# EAGLE design RasPi_plate (EAGLE 7.4.0)
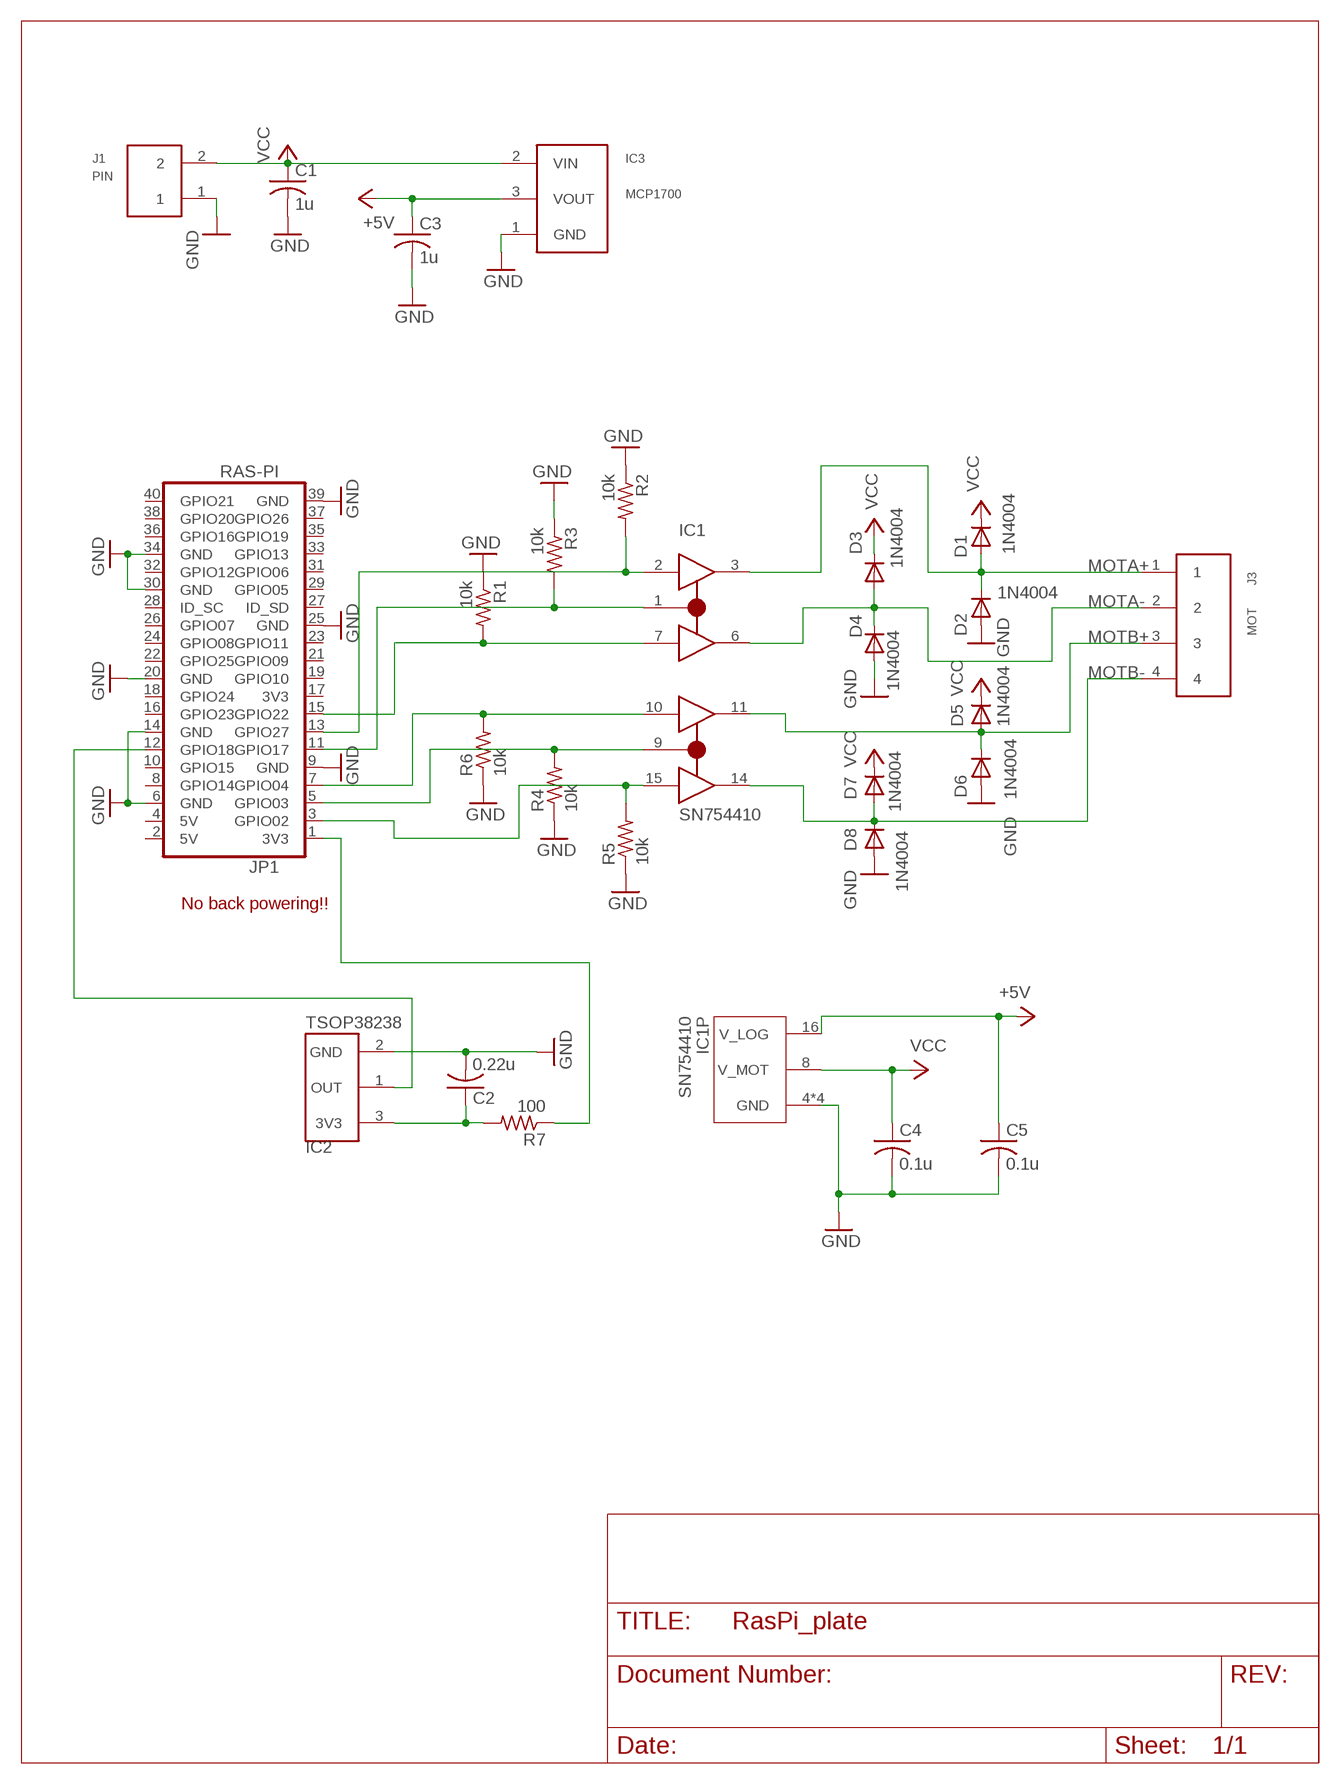
[diagram p0: schematic, sheet 1]

## Parts
C1  1u  C-USC0805  [C0805]
C2  0.22u  C-USC0805  [C0805]
C3  1u  C-USC0805  [C0805]
C4  0.1u  C-USC0805  [C0805]
C5  0.1u  C-USC0805  [C0805]
D1  1N4004  [DO41-10]
D2  1N4004  [DO41-10]
D3  1N4004  [DO41-10]
D4  1N4004  [DO41-10]
D5  1N4004  [DO41-10]
D6  1N4004  [DO41-10]
D7  1N4004  [DO41-10]
D8  1N4004  [DO41-10]
IC1  SN754410  [DIL16]
IC2  TSOP38238  [TSOP38238]
IC3  MCP1700  [TO92]
J1  PIN  2PINHEADER  [2PINHEAD]
J3  MOT  4PINHEADER  [4PINHEAD]
JP1  RAS-PI  40W_PI_HAT_TPH  [2X20]
R1  10k  R-US_R0805  [R0805]
R2  10k  R-US_R0805  [R0805]
R3  10k  R-US_R0805  [R0805]
R4  10k  R-US_R0805  [R0805]
R5  10k  R-US_R0805  [R0805]
R6  10k  R-US_R0805  [R0805]
R7  100  R-US_R0805  [R0805]

## Nets
1EN: IC1.1(1,2EN) JP1.11(GPIO17) R3.2
+3V3: C3.1 C5.1 IC1.16(V_LOG) IC3.3(VOUT) ; supply symbol labelled +5V
GND: C1.2 C2.2 C3.2 C4.2 C5.2 D2.A D4.A D6.A D8.A IC1.4(GND) IC1.5(GND) IC1.12(GND) IC1.13(GND) IC2.2(GND) IC3.1(GND) J1.1 JP1.6(GND) JP1.9(GND) JP1.14(GND) JP1.20(GND) JP1.25(GND) JP1.30(GND) JP1.34(GND) JP1.39(GND) R1.1 R2.1 R3.1 R4.1 R5.1 R6.1
MOTA+ [Power]: D1.A D2.C IC1.3(1Y) J3.1
MOTA- [Power]: D3.A D4.C IC1.6(2Y) J3.2
MOTB+ [Power]: D5.A D6.C IC1.11(3Y) J3.3
MOTB- [Power]: D7.A D8.C IC1.14(4Y) J3.4
N$2: IC1.7(2A) JP1.15(GPIO22) R1.2
N$4: IC1.10(3A) JP1.7(GPIO04) R6.2
N$5: IC1.9(3,4EN) JP1.5(GPIO03) R4.2
N$6: IC2.1(OUT) JP1.12(GPIO18)
N$7: C2.1 IC2.3(3V3) R7.2
N$8: JP1.1(3V3) R7.1
N$9: IC1.2(1A) JP1.13(GPIO27) R2.2
N$12: IC1.15(4A) JP1.3(GPIO02) R5.2
VCC [Power]: C1.1 C4.1 D1.C D3.C D5.C D7.C IC1.8(V_MOT) IC3.2(VIN) J1.2
Unconnected: JP1.2(5V) JP1.4(5V) JP1.8(GPIO14) JP1.10(GPIO15) JP1.16(GPIO23) JP1.17(3V3) JP1.18(GPIO24) JP1.19(GPIO10) JP1.21(GPIO09) JP1.22(GPIO25) JP1.23(GPIO11) JP1.24(GPIO08) JP1.26(GPIO07) JP1.27(ID_SD) JP1.28(ID_SC) JP1.29(GPIO05) JP1.31(GPIO06) JP1.32(GPIO12) JP1.33(GPIO13) JP1.35(GPIO19) JP1.36(GPIO16) JP1.37(GPIO26) JP1.38(GPIO20) JP1.40(GPIO21)

## Notes on the sheet
- No back powering!!

## Library data of the parts
C1 C3 = rcl:C-US: CAPACITOR, American symbol; MPN: EMK212B7105KD-T; OC_NEWARK: 77M8435
C2 = rcl:C-US: CAPACITOR, American symbol; MPN: MC0805B224M250CT; OC_NEWARK: 06R3809
C4 C5 = rcl:C-US: CAPACITOR, American symbol; MPN: C2012X7R1H104K085AA; OC_NEWARK: 04X3288
D1-D8 = diode:1N4004: DIODE general purpose rectifier, 1 A; MPN: 1N4007-E3/54; OC_NEWARK: 05R5987
IC1 = PiDemo_Parts:SN754410; MF: TEXAS INSTRUMENTS; MPN: SN754410NE; OC_NEWARK: 08F8145
IC2 = PiDemo_Parts:TSOP38238: TSOP38238 IR sensor For more information see here <http://www.adafruit.com/product/157>.; MPN: TSOP38238; OC_NEWARK: 02P9885
IC3 = PiDemo_Parts:MCP1700: 1.2V, 1.8V, 2.5V, 2.8V, 3.0V, 3.3V, 5.0V 250mA Regulator; MPN: MCP1700-5002E/TO; OC_NEWARK: 34M7415
J1 = DualBridge:2PINHEADER: 2-PIN HEADER 2.54mm; OC_NEWARK: unknown
J3 = DualBridge:4PINHEADER: 4 Pin Header 2.54mm Spacing; OC_NEWARK: unknown
JP1 = PiDemo_Parts:40W_PI_HAT_TPH: PIN HEADER; OC_NEWARK: unknown
R1-R6 = rcl:R-US_: RESISTOR, American symbol; MPN: MCHP05W4F1002T5E; OC_NEWARK: 01N6989
R7 = rcl:R-US_: RESISTOR, American symbol; MPN: MCHP05W4F1000T5E; OC_NEWARK: 01N6987

## Net classes
1 Power: width 0.508 mm

## Board
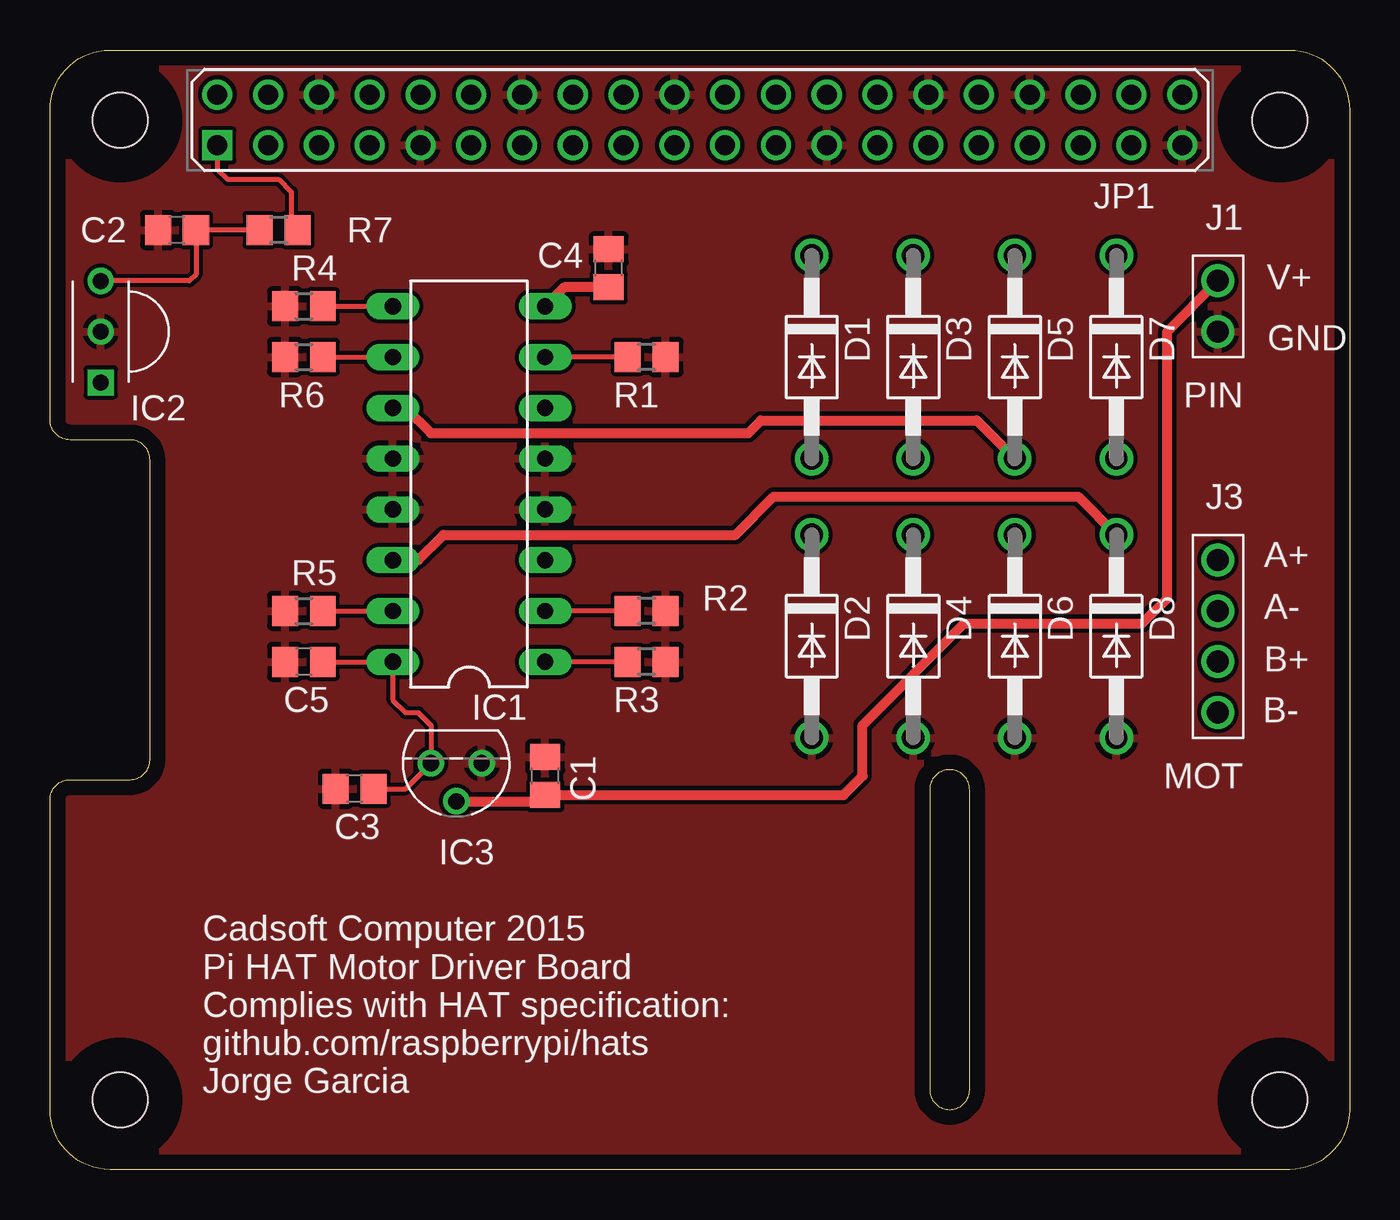
[diagram p1: board, top side]
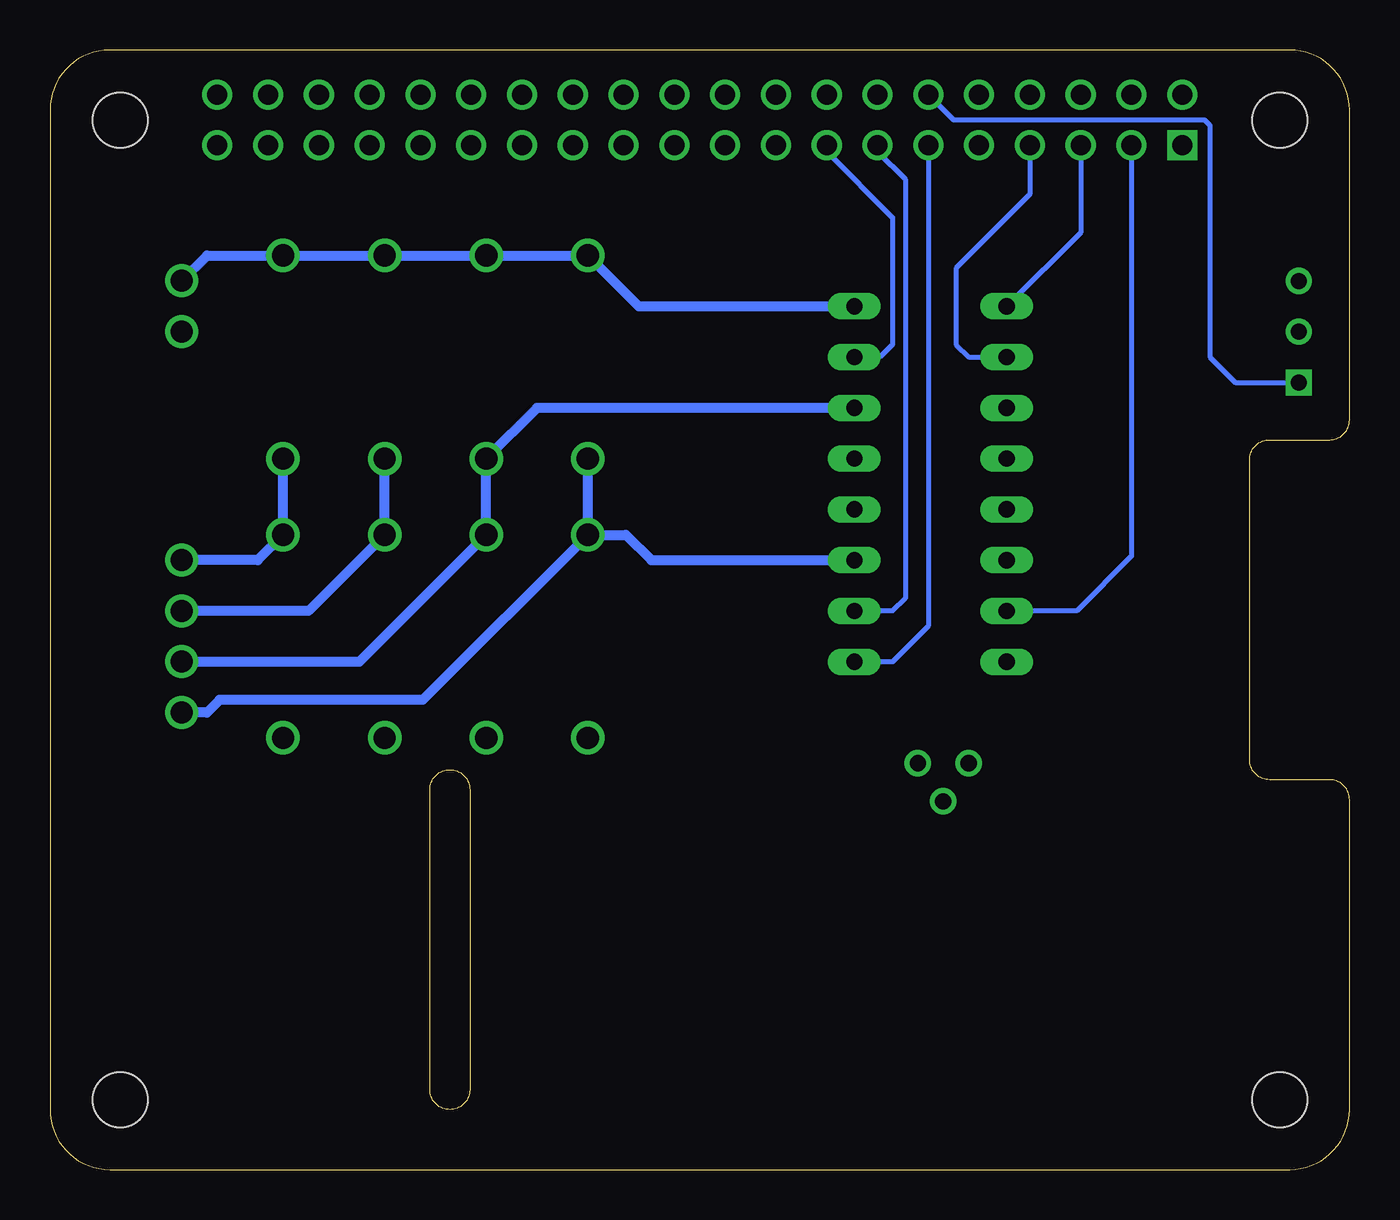
[diagram p2: board, bottom side, seen from below]

Size 65 x 56 mm. Coordinates in mm from the lower left corner, seen from the top.
Copper layers (1*16): Top 0.035mm / dielectric 1.5mm / Bottom 0.035mm
Design rules "default *": minimum track width 10mil, minimum drill 24mil, track to track 8mil, track to pad 8mil, pad to pad 8mil, via to via 8mil, smd to smd 8mil, copper to edge 30mil, drill to drill 8mil, minimum pad ring 10mil, minimum via ring 8mil, stop-mask expansion 4mil, vias tented up to drill 0mil, thermal gap 10mil

### Footprints (pad centres in the part's own frame; a part is rotated, then mirrored left to right if it is on the bottom)
C0805 = smd 1.3 x 1.5: 1 -0.95,0; 2 0.95,0
DO41-10 = drill 1.118: A 5.08,0; C -5.08,0
DIL16 = drill 0.813 long: 1 -8.89,-3.81; 2 -6.35,-3.81; 3 -3.81,-3.81; 4 -1.27,-3.81; 5 1.27,-3.81; 6 3.81,-3.81; 7 6.35,-3.81; 8 8.89,-3.81; 9 8.89,3.81; 10 6.35,3.81; 11 3.81,3.81; 12 1.27,3.81; 13 -1.27,3.81; 14 -3.81,3.81; 15 -6.35,3.81; 16 -8.89,3.81
TSOP38238 = drill 0.8 square: 1 -2.54,0 | drill 0.8: 2 0,0; 3 2.54,0
TO92 = drill 0.813: 1 -1.27,0; 2 0,1.905; 3 1.27,0
2PINHEAD = drill 1.1: 1 -1.27,0; 2 1.27,0
4PINHEAD = drill 1.1: 1 -3.81,0; 2 -1.27,0; 3 1.27,0; 4 3.81,0
2X20 = drill 1 square: 1 -24.13,-1.27 | drill 1: 2 -24.13,1.27; 3 -21.59,-1.27; 4 -21.59,1.27; 5 -19.05,-1.27; 6 -19.05,1.27; 7 -16.51,-1.27; 8 -16.51,1.27; 9 -13.97,-1.27; 10 -13.97,1.27; 11 -11.43,-1.27; 12 -11.43,1.27; 13 -8.89,-1.27; 14 -8.89,1.27; 15 -6.35,-1.27; 16 -6.35,1.27; 17 -3.81,-1.27; 18 -3.81,1.27; 19 -1.27,-1.27; 20 -1.27,1.27; 21 1.27,-1.27; 22 1.27,1.27; 23 3.81,-1.27; 24 3.81,1.27; 25 6.35,-1.27; 26 6.35,1.27; 27 8.89,-1.27; 28 8.89,1.27; 29 11.43,-1.27; 30 11.43,1.27; 31 13.97,-1.27; 32 13.97,1.27; 33 16.51,-1.27; 34 16.51,1.27; 35 19.05,-1.27; 36 19.05,1.27; 37 21.59,-1.27; 38 21.59,1.27; 39 24.13,-1.27; 40 24.13,1.27
R0805 = smd 1.3 x 1.5: 1 -0.95,0; 2 0.95,0
PI_HAT_STANDARD_TPH = hole 2.75: 3.5,52.5; 61.5,52.5; 3.5,3.5; 61.5,3.5

### Placement (x,y rotation side)
C1  24.77,19.68 90 top
C2  6.35,46.99 180 top
C3  15.24,19.05 180 top
C4  27.94,45.09 90 top
C5  12.7,25.4 180 top
D1  38.1,40.64 270 top
D2  38.1,26.67 270 top
D3  43.18,40.64 270 top
D4  43.18,26.67 270 top
D5  48.26,40.64 270 top
D6  48.26,26.67 270 top
D7  53.34,40.64 270 top
D8  53.34,26.67 270 top
IC1  20.95,34.29 90 top
IC2  2.54,41.91 90 top
IC3  20.32,20.32 180 top
J1  58.42,43.18 90 top
J3  58.42,26.67 90 top
JP1  32.5,52.5 0 top
R1  29.84,40.64 180 top
R2  29.84,27.94 180 top
R3  29.84,25.4 180 top
R4  12.7,43.18 0 top
R5  12.7,27.94 0 top
R6  12.7,40.64 0 top
R7  11.43,46.99 180 top
U$1  [PI_HAT_STANDARD_TPH]  0,0 0 top

### Tracks (layer width: path | path; a pad name or v marks a point on that pad's centre or on a via)
1EN
  Top 0.254: R3.2 IC1.1
  Bottom 0.254: JP1.11 21.07,27.19 22.86,25.4 IC1.1
+3V3
  Top 0.254: C5.1 IC1.16 17.14,23.5 17.78,22.86 18.41,22.86 19.05,22.23 IC3.3 17.78,19.05 C3.1
GND
  pour Top: 0,57.15 64.77,57.15 64.77,0 0,0
MOTA+
  Bottom 0.508: D2.C 46.35,23.5 56.52,23.5 57.15,22.86 J3.1 | D2.C D1.A | D2.C 36.2,31.75 34.92,30.48 IC1.3
MOTA-
  Bottom 0.508: J3.2 49.53,25.4 D4.C D3.A 40.64,38.1 IC1.6
MOTB+
  Top 0.508: IC1.11 17.78,38.1 19.05,36.83 34.92,36.83 35.56,37.47 46.35,37.47 D5.A
  Bottom 0.508: J3.3 52.07,27.94 D6.C D5.A
MOTB-
  Top 0.508: IC1.14 18.41,30.48 19.68,31.75 34.29,31.75 36.2,33.66 51.44,33.66 D8.C
  Bottom 0.508: J3.4 54.61,30.48 D8.C D7.A
N$2
  Top 0.254: R1.2 IC1.7
  Bottom 0.254: JP1.15 26.15,50.91 22.86,47.62 22.86,41.27 23.5,40.64 IC1.7
N$4
  Top 0.254: R6.2 IC1.10
  Bottom 0.254: JP1.7 15.99,48.78 19.68,45.09 19.68,41.27 19.05,40.64 IC1.10
N$5
  Top 0.254: R4.2 IC1.9
  Bottom 0.254: JP1.5 13.45,46.88 IC1.9
N$6
  Bottom 0.254: IC2.1 5.71,39.37 6.99,40.64 6.99,52.23 7.25,52.5 19.8,52.5 JP1.12
N$7
  Top 0.254: R7.2 C2.1 7.3,44.77 6.99,44.45 IC2.3
N$8
  Top 0.254: JP1.1 8.37,50.05 8.89,49.53 11.43,49.53 12.06,48.9 12.06,47.3 R7.1
N$9
  Top 0.254: R2.2 IC1.2
  Bottom 0.254: JP1.13 23.61,50.91 22.23,49.53 22.23,28.57 22.86,27.94 IC1.2
N$12
  Top 0.254: R5.2 IC1.15
  Bottom 0.254: JP1.3 10.91,30.68 R5.2 IC1.15
VCC
  Top 0.508: C4.1 25.72,44.13 IC1.8 | IC3.2 24.45,18.41 C1.1 39.69,18.73 40.64,19.68 40.64,22.23 45.72,27.3 54.61,27.3 55.88,28.57 55.88,41.91 J1.2
  Bottom 0.508: J1.2 57.15,45.72 D7.C D5.C D3.C D1.C 35.56,43.18 IC1.8

### Text on the board
tPlace: V+ | GND | A+ | A- | B+ | B- | Cadsoft Computer 2015 / Pi HAT Motor Driver Board / Complies with HAT specification: / github.com/raspberrypi/hats | Jorge Garcia